# Altium schematic sheet TE0123.V2_Esquema_2022-08-20.schdoc
size 612 x 429 mm
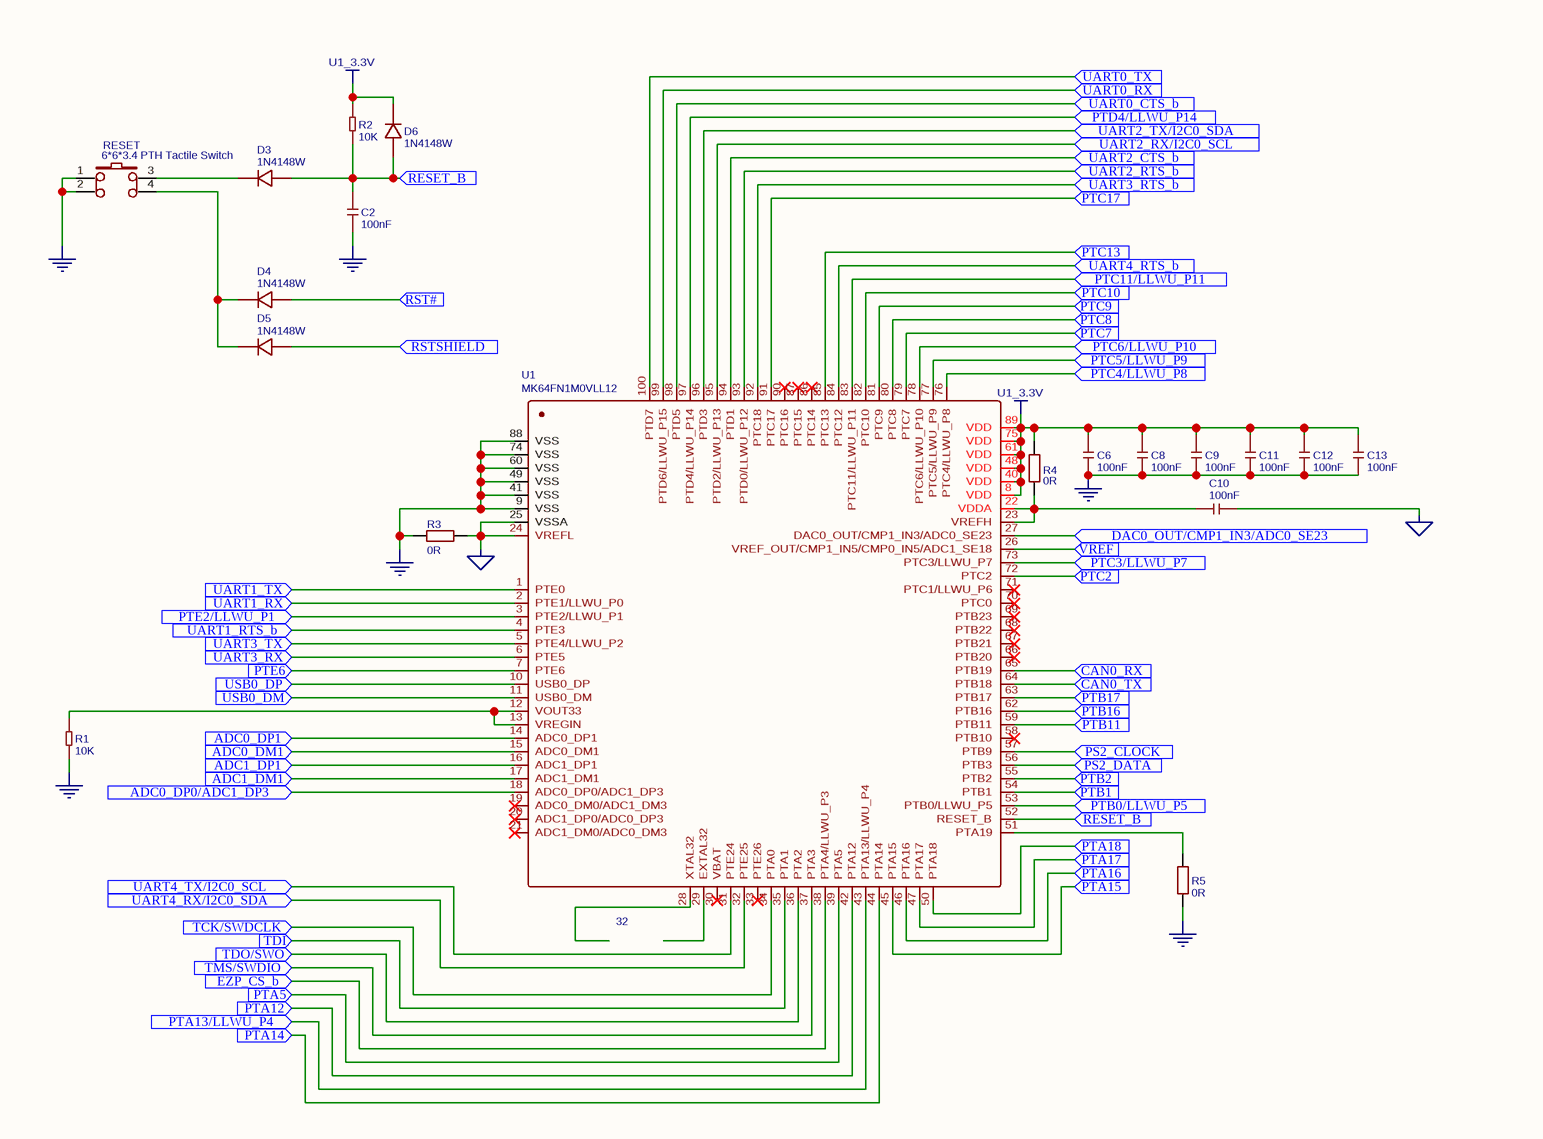
[diagram p0: TE0123.V2_Esquema_2022-08-20.schdoc, top left]
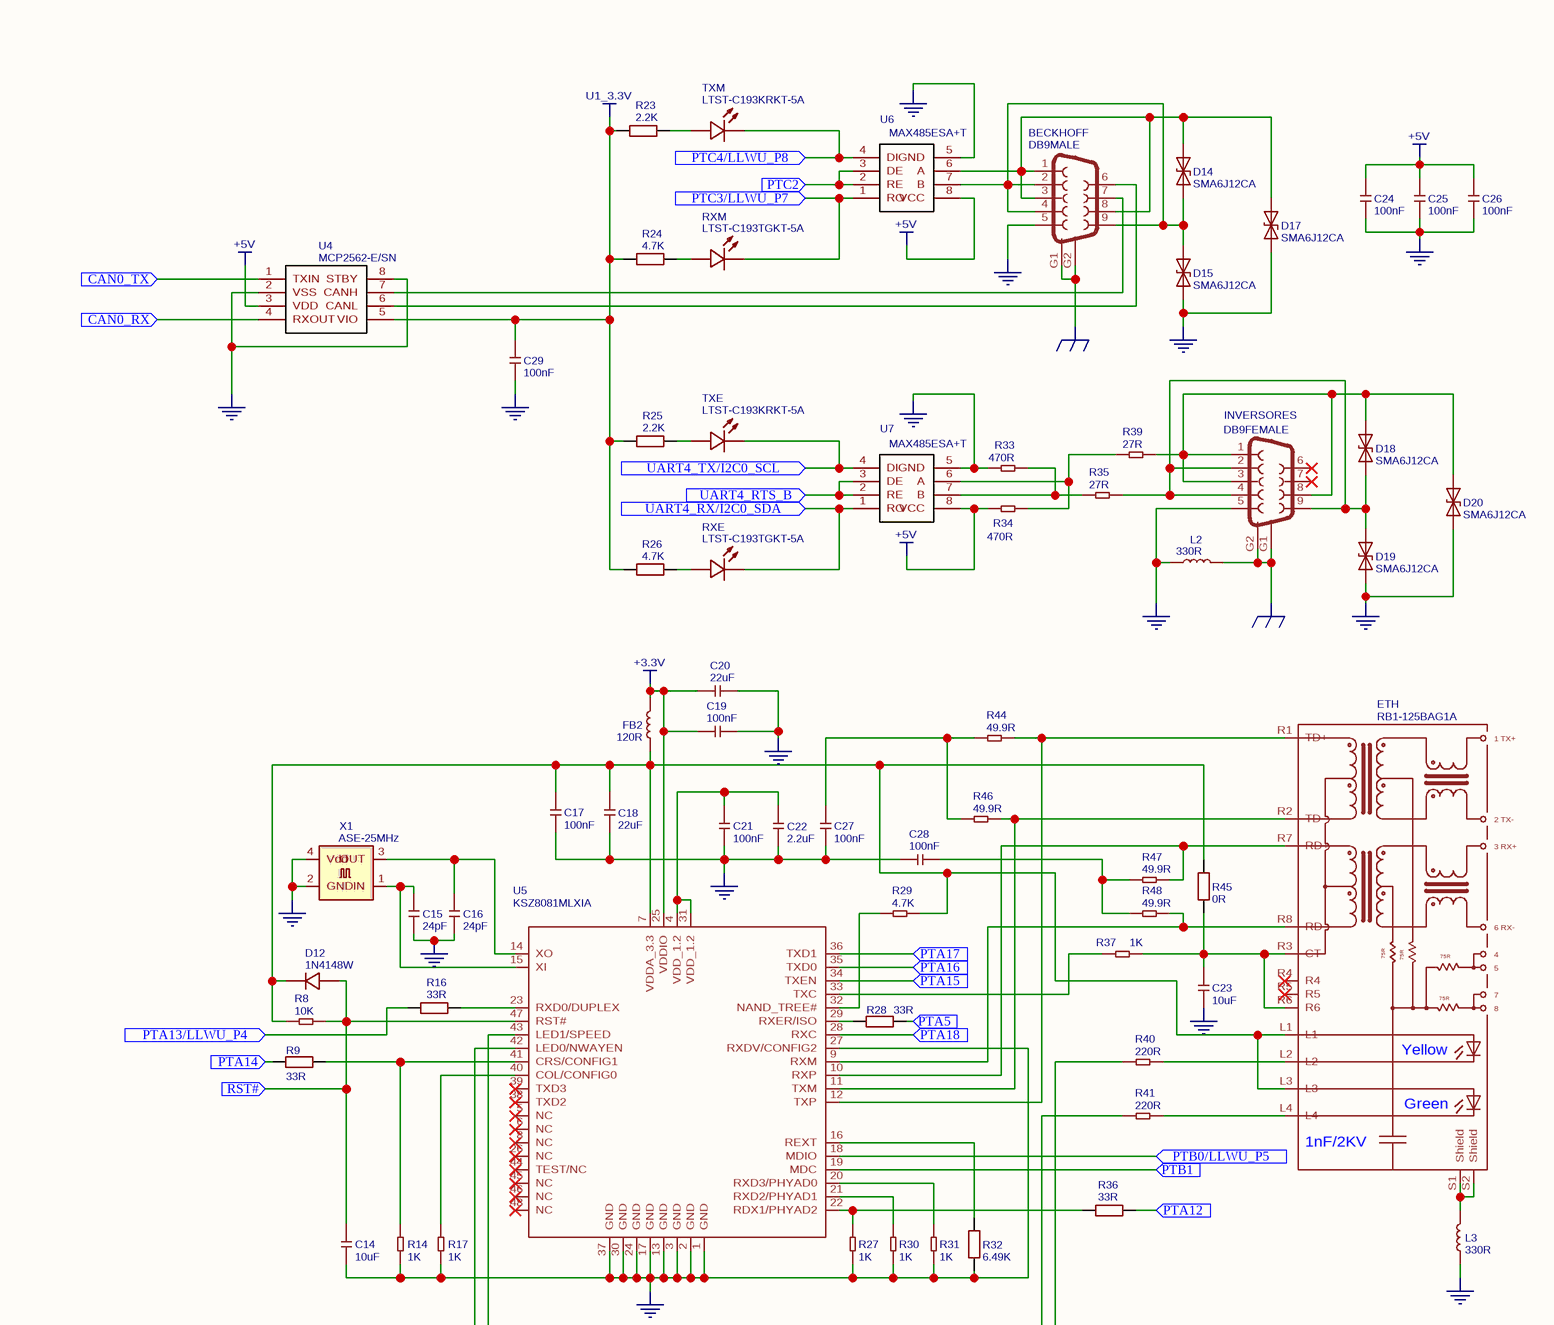
[diagram p1: TE0123.V2_Esquema_2022-08-20.schdoc, top right]
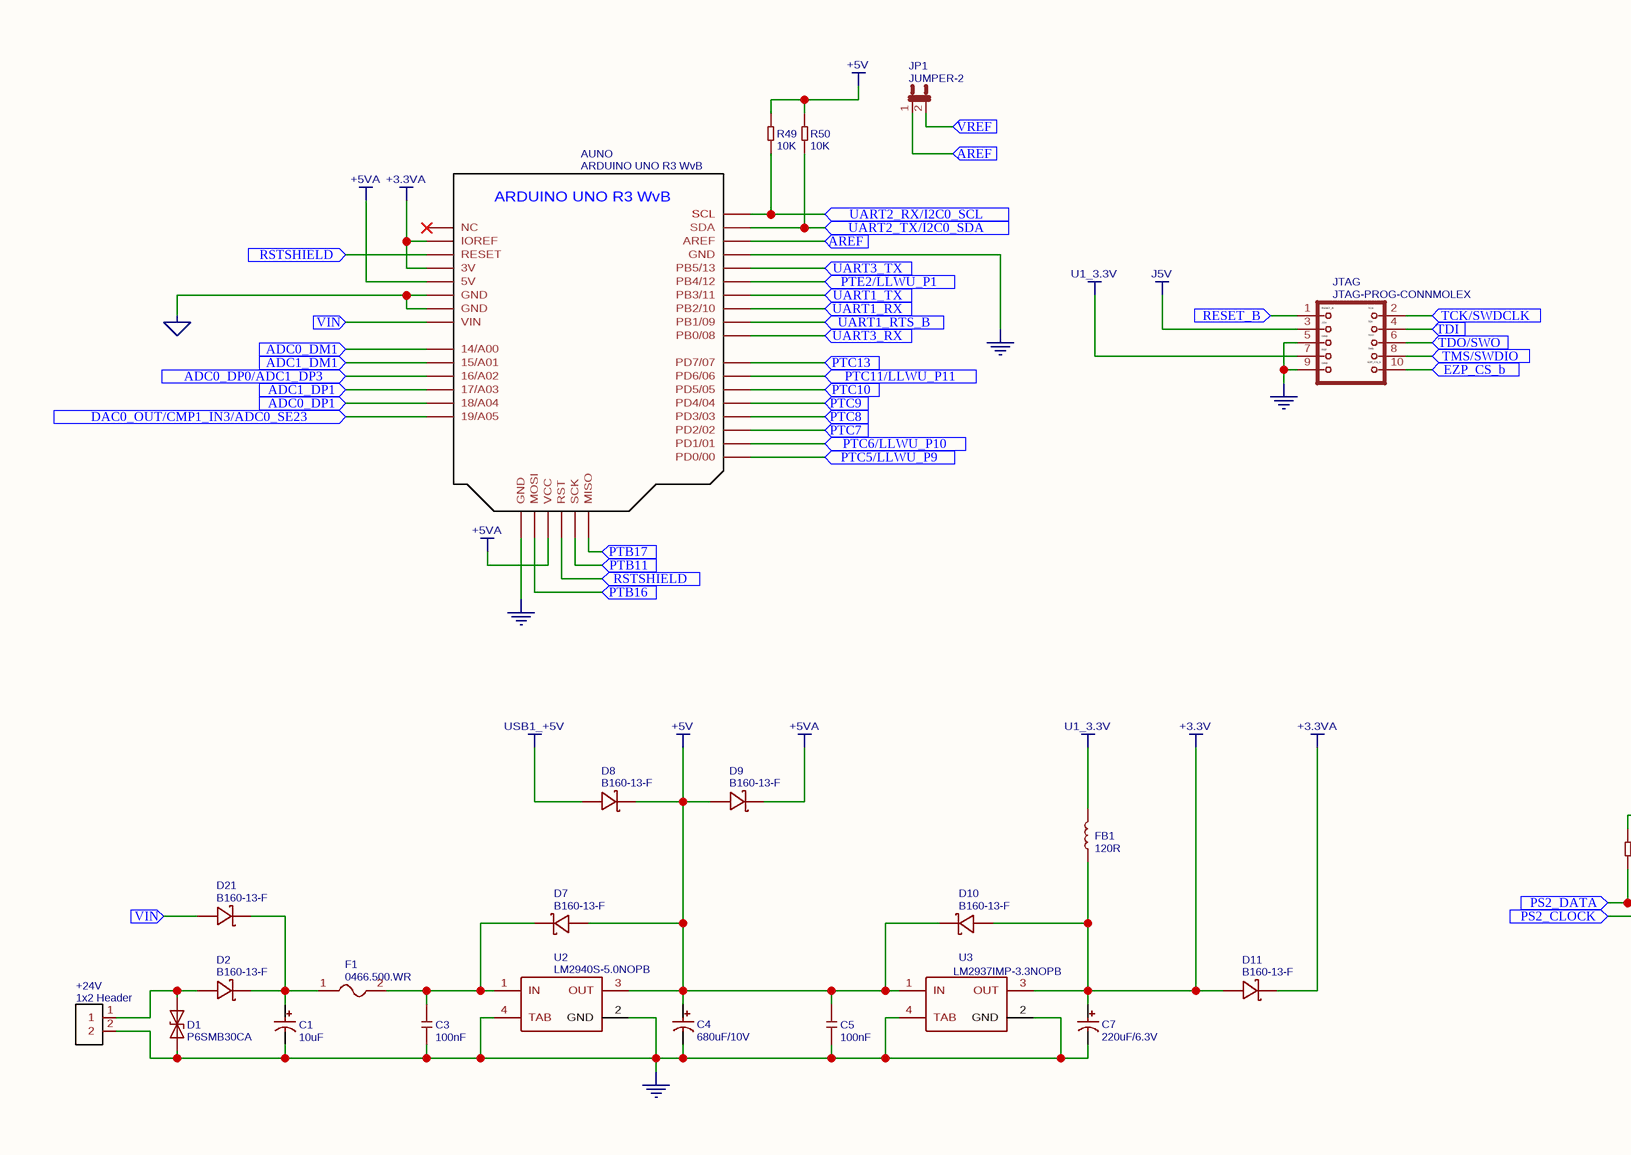
[diagram p2: TE0123.V2_Esquema_2022-08-20.schdoc, bottom left]
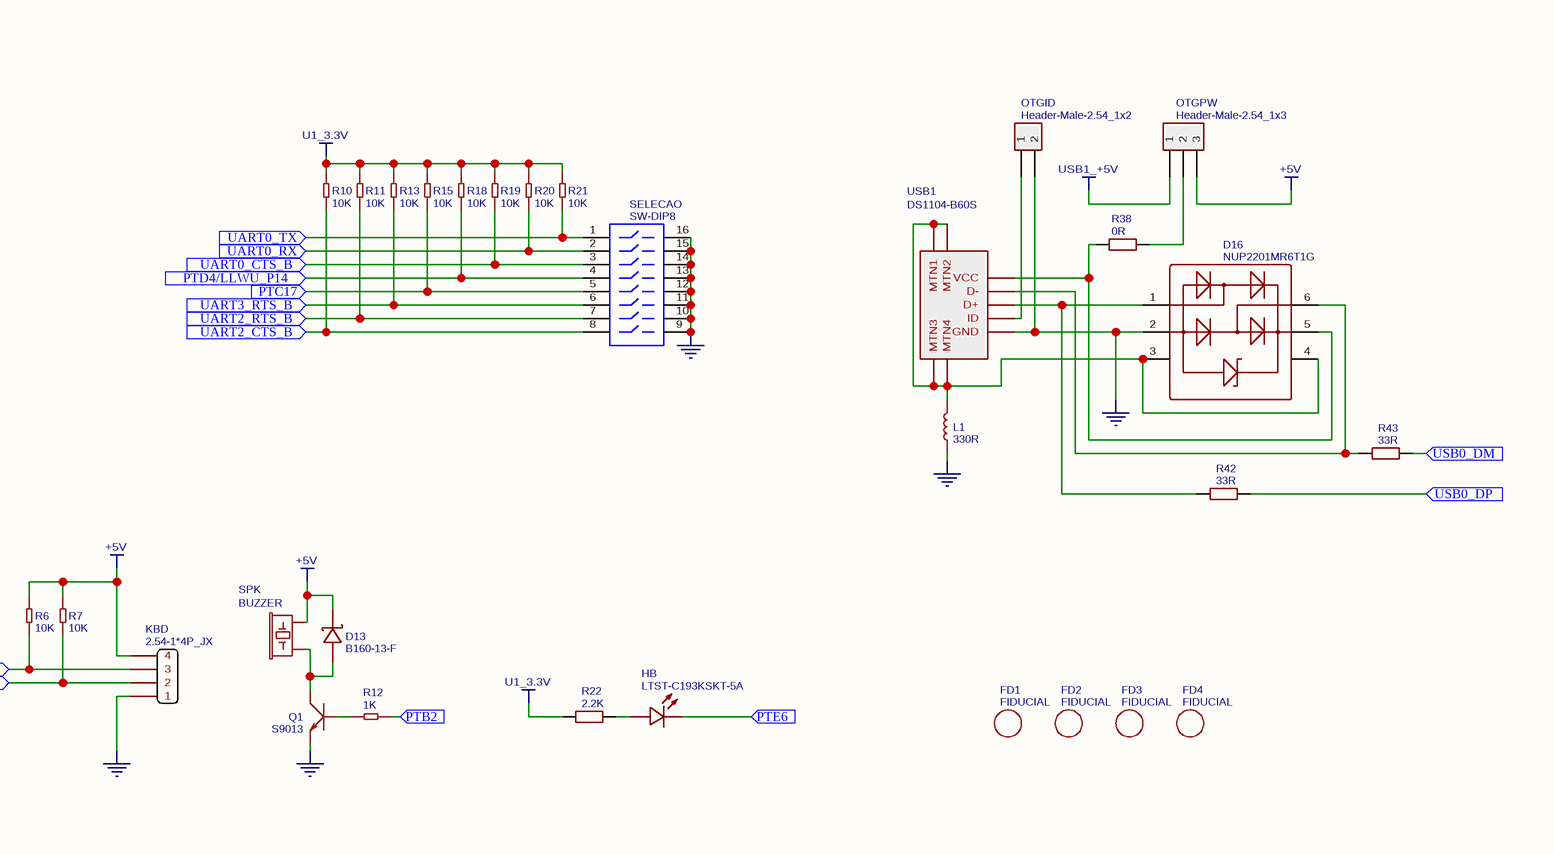
[diagram p3: TE0123.V2_Esquema_2022-08-20.schdoc, bottom right]

## Parts
32  32.768KHz  [SMD-1610_2P]  (value not drawn)
+24V  1x2 Header  [HDR1X2]
AUNO  ARDUINO UNO R3 WvB  [12ARDUINO UNO R3 NOSILK NOHOLES]
BECKHOFF  DB9MALE  [DB9_MALE]
C1  10uF  [CAP-D5.0XF2.0]
C2  100nF  [C0603]
C3  100nF  [C0603]
C4  680uF/10V  [CAP-D8.0XF3.5]
C5  100nF  [C0603]
C6  100nF  [C0603]
C7  220uF/6.3V  [CAP-D5.0XF2.0]
C8  100nF  [C0603]
C9  100nF  [C0603]
C10  100nF  [C0603]
C11  100nF  [C0603]
C12  100nF  [C0603]
C13  100nF  [C0603]
C14  10uF  [C0805]
C15  24pF  [C0603]
C16  24pF  [C0603]
C17  100nF  [C0603]
C18  22uF  [C0805]
C19  100nF  [C0603]
C20  22uF  [C0805]
C21  100nF  [C0603]
C22  2.2uF  [C0603]
C23  10uF  [C0805]
C24  100nF  [C0603]
C25  100nF  [C0603]
C26  100nF  [C0603]
C27  100nF  [C0603]
C28  100nF  [C0603]
C29  100nF  [C0603]
D1  P6SMB30CA  [SMA(DO-214ACA)]
D2  B160-13-F  [SMA(DO-214AC)]
D3  1N4148W  [SOD-123]
D4  1N4148W  [SOD-123]
D5  1N4148W  [SOD-123]
D6  1N4148W  [SOD-123]
D7  B160-13-F  [SMA(DO-214AC)]
D8  B160-13-F  [SMA(DO-214AC)]
D9  B160-13-F  [SMA(DO-214AC)]
D10  B160-13-F  [SMA(DO-214AC)]
D11  B160-13-F  [SMA(DO-214AC)]
D12  1N4148W  [SOD-123]
D13  B160-13-F  [SMA(DO-214AC)]
D14  SMA6J12CA  [SMA(DO-214ACA)]
D15  SMA6J12CA  [SMA(DO-214ACA)]
D16  NUP2201MR6T1G  [SOT-23-6]
D17  SMA6J12CA  [SMA(DO-214ACA)]
D18  SMA6J12CA  [SMA(DO-214ACA)]
D19  SMA6J12CA  [SMA(DO-214ACA)]
D20  SMA6J12CA  [SMA(DO-214ACA)]
D21  B160-13-F  [SMA(DO-214AC)]
ETH  RB1-125BAG1A  [RB1-125BAG1A]
F1  0466.500.WR  [1206]
FB1  120R  [L0603]
FB2  120R  [L0603]
FD1  FIDUCIAL  [FIDUCIAL_1MM]
FD2  FIDUCIAL  [FIDUCIAL_1MM]
FD3  FIDUCIAL  [FIDUCIAL_1MM]
FD4  FIDUCIAL  [FIDUCIAL_1MM]
HB  LTST-C193KSKT-5A  [0603]
INVERSORES  DB9FEMALE  [DB9]
JP1  JUMPER-2  [SJ_2S-NO-NS]
JTAG  JTAG-PROG-CONNMOLEX  [JTAG-10PIN-2.54MM-PTH]
KBD  2.54-1*4P_JX  [H4-2.54]
L1  330R  [L0805]
L2  330R  [L0805]
L3  330R  [L0805]
OTGID  Header-Male-2.54_1x2  [HDR-2X1/2.54]
OTGPW  Header-Male-2.54_1x3  [HDR-3X1/2.54]
Q1  S9013  [SEEED-SOT-23]
R1  10K  [R0603]
R2  10K  [R0603]
R3  0R  [0603]
R4  0R  [0603]
R5  0R  [0603]
R6  10K  [R0603]
R7  10K  [R0603]
R8  10K  [R0603]
R9  33R  [0603]
R10  10K  [R0603]
R11  10K  [R0603]
R12  1K  [R0603]
R13  10K  [R0603]
R14  1K  [R0603]
R15  10K  [R0603]
R16  33R  [0603]
R17  1K  [R0603]
R18  10K  [R0603]
R19  10K  [R0603]
R20  10K  [R0603]
R21  10K  [R0603]
R22  2.2K  [0603]
R23  2.2K  [0603]
R24  4.7K  [0603]
R25  2.2K  [0603]
R26  4.7K  [0603]
R27  1K  [R0603]
R28  33R  [0603]
R29  4.7K  [R0603]
R30  1K  [R0603]
R31  1K  [R0603]
R32  6.49K  [0603]
R33  470R  [R0805]
R34  470R  [R0805]
R35  27R  [R0805]
R36  33R  [0603]
R37  1K  [R0603]
R38  0R  [0603]
R39  27R  [R0805]
R40  220R  [R0603]
R41  220R  [R0603]
R42  33R  [0603]
R43  33R  [0603]
R44  49.9R  [R0603]
R45  0R  [0603]
R46  49.9R  [R0603]
R47  49.9R  [R0603]
R48  49.9R  [R0603]
R49  10K  [R0603]
R50  10K  [R0603]
RESET  6*6*3.4 PTH Tactile Switch  [TACTILE SWITCH]
RXE  LTST-C193TGKT-5A  [0603]
RXM  LTST-C193TGKT-5A  [0603]
SELECAO  SW-DIP8  [DIP SWITCH 16]
SPK  BUZZER  [BUZZER-12MM-KIT]
TXE  LTST-C193KRKT-5A  [0603]
TXM  LTST-C193KRKT-5A  [0603]
U1  MK64FN1M0VLL12  [LQFP-100_14X14X05P]
U2  LM2940S-5.0NOPB  [TS3B]
U3  LM2937IMP-3.3NOPB  [SOT-223]
U4  MCP2562-E/SN  [SOP-8_150MIL]
U5  KSZ8081MLXIA  [LQFP48]
U6  MAX485ESA+T  [SOIC-8_150MIL]
U7  MAX485ESA+T  [SOIC-8_150MIL]
USB1  DS1104-B60S  [MICRO-USB-13]
X1  ASE-25MHz  [OSCILLATOR_SMD_ABRACON_ASE-4PIN_3.2X2.5MM]

## Ports
ADC0_DM1 (in), ADC0_DP0/ADC1_DP3 (in), ADC0_DP1 (in), ADC1_DM1 (in), ADC1_DP1 (in), AREF (in), CAN0_RX (in), CAN0_TX (in), DAC0_OUT/CMP1_IN3/ADC0_SE23 (in), EZP_CS_b (in), PS2_CLOCK (in), PS2_DATA (in), PTA5 (in), PTA12 (in), PTA13/LLWU_P4 (in), PTA14 (in), PTA15 (in), PTA16 (in), PTA17 (in), PTA18 (in), PTB0/LLWU_P5 (in), PTB1 (in), PTB2 (in), PTB11 (in), PTB16 (in), PTB17 (in), PTC2 (in), PTC3/LLWU_P7 (in), PTC4/LLWU_P8 (in), PTC5/LLWU_P9 (in), PTC6/LLWU_P10 (in), PTC7 (in), PTC8 (in), PTC9 (in), PTC10 (in), PTC11/LLWU_P11 (in), PTC13 (in), PTC17 (in), PTD4/LLWU_P14 (in), PTE2/LLWU_P1 (in), PTE6 (in), RESET_B (in), RST# (in), RSTSHIELD (in), TCK/SWDCLK (in), TDI (in), TDO/SWO (in), TMS/SWDIO (in), UART0_CTS_b (in), UART0_CTS_B (in), UART0_RX (in), UART0_TX (in), UART1_RTS_b (in), UART1_RTS_B (in), UART1_RX (in), UART1_TX (in), UART2_CTS_b (in), UART2_CTS_B (in), UART2_RTS_b (in), UART2_RTS_B (in), UART2_RX/I2C0_SCL (in), UART2_TX/I2C0_SDA (in), UART3_RTS_b (in), UART3_RTS_B (in), UART3_RX (in), UART3_TX (in), UART4_RTS_b (in), UART4_RTS_B (in), UART4_RX/I2C0_SDA (in), UART4_TX/I2C0_SCL (in), USB0_DM (in), USB0_DP (in), VIN (in), VREF (in)

## Nets
+3.3V: C7.1 C19.2 C20.1 D10.1(A) D11.1(A) FB1.1 FB2.1 U3.3(OUT) U5.25(VDDIO)
+3.3VA: AUNO.29(3V) AUNO.31(IOREF) D11.2(K)
+5V: C4.1 C5.2 C24.2 C25.2 C26.2 D7.1(A) D8.2(K) D9.1(A) D10.2(K) D13.2(K) KBD.4 OTGPW.3 R6.2 R7.2 R34.2 R49.2 R50.2 SPK.+ U2.3(OUT) U3.1(IN) U4.3(VDD) U6.8(VCC) U7.8(VCC)
+5VA: AUNO.28(5V) AUNO.37(VCC) D9.2(K)
AGND: AUNO.26(GND) AUNO.27(GND) C10.1 R3.2 U1.24(VREFL) U1.25(VSSA)
CHASSI_RS485: BECKHOFF.G1 BECKHOFF.G2 INVERSORES.G1 INVERSORES.G2 L2.1
GND: +24V.2 AUNO.15(GND) AUNO.38(GND) BECKHOFF.5 C1.2 C2.1 C3.1 C4.2 C5.1 C6.1 C7.2 C8.1 C9.1 C11.1 C12.1 C13.2 C14.1 C15.1 C16.1 C17.1 C18.1 C19.1 C20.2 C21.1 C22.1 C23.1 C24.1 C25.1 C26.1 C27.1 C28.2 C29.1 D1.2(A) D15.2(A) D16.2 D17.2(A) D19.2(A) D20.2(A) INVERSORES.5 JTAG.5 JTAG.9 KBD.1 L1.1 L2.2 L3.1 OTGID.2 Q1.2(E) R1.1 R3.1 R5.1 R14.2 R17.2 R27.1 R30.1 R31.1 R32.1 R33.2 RESET.1 RESET.2 SELECAO.9 SELECAO.10 SELECAO.11 SELECAO.12 SELECAO.13 SELECAO.14 SELECAO.15 SELECAO.16 U1.9(VSS) U1.41(VSS) U1.49(VSS) U1.60(VSS) U1.74(VSS) U1.88(VSS) U2.2(GND) U2.4(TAB) U3.2(GND) U3.4(TAB) U4.2(VSS) U4.8(STBY) U5.1(GND) U5.2(GND) U5.3(GND) U5.13(GND) U5.17(GND) U5.24(GND) U5.27(RXDV/CONFIG2) U5.30(GND) U5.37(GND) U6.5(GND) U7.5(GND) USB1.5(GND) X1.2(GND) X1.4(Vdd)
J5V: JTAG.3
U1_3.3V: C6.2 C8.2 C9.2 C11.2 C12.2 C13.1 C29.2 D6.1(K) FB1.2 JTAG.7 R2.2 R4.2 R10.2 R11.2 R13.2 R15.2 R18.2 R19.2 R20.2 R21.2 R22.1 R23.1 R24.1 R25.1 R26.1 U1.8(VDD) U1.40(VDD) U1.48(VDD) U1.61(VDD) U1.75(VDD) U1.89(VDD) U4.5(VIO)
USB1_+5V: D8.1(A) OTGPW.1
ADC0_DM1: AUNO.24(14/A00) U1.15(ADC0_DM1) ; port ADC0_DM1
ADC0_DP0/ADC1_DP3: AUNO.22(16/A02) U1.18(ADC0_DP0/ADC1_DP3) ; port ADC0_DP0/ADC1_DP3
ADC0_DP1: AUNO.20(18/A04) U1.14(ADC0_DP1) ; port ADC0_DP1
ADC1_DM1: AUNO.23(15/A01) U1.17(ADC1_DM1) ; port ADC1_DM1
ADC1_DP1: AUNO.21(17/A03) U1.16(ADC1_DP1) ; port ADC1_DP1
AREF: AUNO.16(AREF) JP1.1 ; port AREF
CAN0_RX: U1.65(PTB19) U4.4(RXOUT) ; port CAN0_RX
CAN0_TX: U1.64(PTB18) U4.1(TXIN) ; port CAN0_TX
DAC0_OUT/CMP1_IN3/ADC0_SE23: AUNO.19(19/A05) U1.27(DAC0_OUT/CMP1_IN3/ADC0_SE23) ; port DAC0_OUT/CMP1_IN3/ADC0_SE23
EZP_CS_b: JTAG.10 U1.38(PTA4/LLWU_P3) ; port EZP_CS_b
PS2_CLOCK: KBD.2 R7.1 U1.57(PTB9) ; port PS2_CLOCK
PS2_DATA: KBD.3 R6.1 U1.56(PTB3) ; port PS2_DATA
PTA5: R28.2 U1.39(PTA5) ; port PTA5
PTA12: R36.1 U1.42(PTA12) ; port PTA12
PTA13/LLWU_P4: R16.1 U1.43(PTA13/LLWU_P4) ; port PTA13/LLWU_P4
PTA14: R9.2 U1.44(PTA14) ; port PTA14
PTA15: U1.45(PTA15) U5.34(TXEN) ; port PTA15
PTA16: U1.46(PTA16) U5.35(TXD0) ; port PTA16
PTA17: U1.47(PTA17) U5.36(TXD1) ; port PTA17
PTA18: U1.50(PTA18) U5.28(RXC) ; port PTA18
PTB0/LLWU_P5: U1.53(PTB0/LLWU_P5) U5.18(MDIO) ; port PTB0/LLWU_P5
PTB1: U1.54(PTB1) U5.19(MDC) ; port PTB1
PTB2: R12.2 U1.55(PTB2) ; port PTB2
PTB11: AUNO.34(SCK) U1.59(PTB11) ; port PTB11
PTB16: AUNO.36(MOSI) U1.62(PTB16) ; port PTB16
PTB17: AUNO.33(MISO) U1.63(PTB17) ; port PTB17
PTC2: U1.72(PTC2) U6.2(RE) U6.3(DE) ; port PTC2
PTC3/LLWU_P7: RXM.1(K) U1.73(PTC3/LLWU_P7) U6.1(RO) ; port PTC3/LLWU_P7
PTC4/LLWU_P8: TXM.1(K) U1.76(PTC4/LLWU_P8) U6.4(DI) ; port PTC4/LLWU_P8
PTC5/LLWU_P9: AUNO.1(PD0/00) U1.77(PTC5/LLWU_P9) ; port PTC5/LLWU_P9
PTC6/LLWU_P10: AUNO.2(PD1/01) U1.78(PTC6/LLWU_P10) ; port PTC6/LLWU_P10
PTC7: AUNO.3(PD2/02) U1.79(PTC7) ; port PTC7
PTC8: AUNO.4(PD3/03) U1.80(PTC8) ; port PTC8
PTC9: AUNO.5(PD4/04) U1.81(PTC9) ; port PTC9
PTC10: AUNO.6(PD5/05) U1.82(PTC10) ; port PTC10
PTC11/LLWU_P11: AUNO.7(PD6/06) U1.83(PTC11/LLWU_P11) ; port PTC11/LLWU_P11
PTC13: AUNO.8(PD7/07) U1.85(PTC13) ; port PTC13
PTC17: R15.1 SELECAO.5 U1.91(PTC17) ; port PTC17
PTD4/LLWU_P14: R18.1 SELECAO.4 U1.97(PTD4/LLWU_P14) ; port PTD4/LLWU_P14
PTE2/LLWU_P1: AUNO.13(PB4/12) U1.3(PTE2/LLWU_P1) ; port PTE2/LLWU_P1
PTE6: HB.1(K) U1.7(PTE6) ; port PTE6
RESET_B: C2.2 D3.2(A) D6.2(A) JTAG.1 R2.1 U1.52(RESET_B) ; port RESET_B
RST#: C14.2 D4.2(A) D12.2(A) R8.1 U5.47(RST#) ; port RST#
RSTSHIELD: AUNO.30(RESET) AUNO.35(RST) D5.2(A) ; port RSTSHIELD
TCK/SWDCLK: JTAG.2 U1.34(PTA0) ; port TCK/SWDCLK
TDI: JTAG.4 U1.35(PTA1) ; port TDI
TDO/SWO: JTAG.6 U1.36(PTA2) ; port TDO/SWO
TMS/SWDIO: JTAG.8 U1.37(PTA3) ; port TMS/SWDIO
UART0_CTS_b: R19.1 SELECAO.3 U1.98(PTD5) ; port UART0_CTS_b, port UART0_CTS_B
UART0_RX: R20.1 SELECAO.2 U1.99(PTD6/LLWU_P15) ; port UART0_RX
UART0_TX: R21.1 SELECAO.1 U1.100(PTD7) ; port UART0_TX
UART1_RTS_b: AUNO.10(PB1/09) U1.4(PTE3) ; port UART1_RTS_b, port UART1_RTS_B
UART1_RX: AUNO.11(PB2/10) U1.2(PTE1/LLWU_P0) ; port UART1_RX
UART1_TX: AUNO.12(PB3/11) U1.1(PTE0) ; port UART1_TX
UART2_CTS_b: R10.1 SELECAO.8 U1.94(PTD1) ; port UART2_CTS_b, port UART2_CTS_B
UART2_RTS_b: R11.1 SELECAO.7 U1.93(PTD0/LLWU_P12) ; port UART2_RTS_b, port UART2_RTS_B
UART2_RX/I2C0_SCL: AUNO.18(SCL) R49.1 U1.95(PTD2/LLWU_P13) ; port UART2_RX/I2C0_SCL
UART2_TX/I2C0_SDA: AUNO.17(SDA) R50.1 U1.96(PTD3) ; port UART2_TX/I2C0_SDA
UART3_RTS_b: R13.1 SELECAO.6 U1.92(PTC18) ; port UART3_RTS_b, port UART3_RTS_B
UART3_RX: AUNO.9(PB0/08) U1.6(PTE5) ; port UART3_RX
UART3_TX: AUNO.14(PB5/13) U1.5(PTE4/LLWU_P2) ; port UART3_TX
UART4_RTS_b: U1.84(PTC12) U7.2(RE) U7.3(DE) ; port UART4_RTS_b, port UART4_RTS_B
UART4_RX/I2C0_SDA: RXE.1(K) U1.32(PTE25) U7.1(RO) ; port UART4_RX/I2C0_SDA
UART4_TX/I2C0_SCL: TXE.1(K) U1.31(PTE24) U7.4(DI) ; port UART4_TX/I2C0_SCL
USB0_DM: R43.2 U1.11(USB0_DM) ; port USB0_DM
USB0_DP: R42.2 U1.10(USB0_DP) ; port USB0_DP
VIN: AUNO.25(VIN) D21.1(A) ; port VIN
VREF: JP1.2 U1.26(VREF_OUT/CMP1_IN5/CMP0_IN5/ADC1_SE18) ; port VREF
Net+24V_1: +24V.1 D1.1(K) D2.1(A)
NetBECKHOFF_1: BECKHOFF.1 BECKHOFF.3 BECKHOFF.8 D14.1(K) D17.1(K) U6.6(A)
NetBECKHOFF_2: BECKHOFF.2 BECKHOFF.4 BECKHOFF.9 D14.2(A) D15.1(K) U6.7(B)
NetBECKHOFF_6: BECKHOFF.6 U4.6(CANL)
NetBECKHOFF_7: BECKHOFF.7 U4.7(CANH)
NetC1_1: C1.1 D2.2(K) D21.2(K) F1.1
NetC3_2: C3.2 D7.2(K) F1.2 U2.1(IN)
NetC10_2: C10.2 R4.1 U1.22(VDDA) U1.23(VREFH)
NetC15_2: C15.2 U5.15(XI) X1.1(IN)
NetC16_2: C16.2 U5.14(XO) X1.3(OUT)
NetC17_2: C17.2 C18.2 D12.1(K) ETH.L1 ETH.L3 FB2.2 R8.2 R29.1 R45.2 U5.7(VDDA_3.3)
NetC21_2: C21.2 C22.2 U5.4(VDD_1.2) U5.31(VDD_1.2)
NetC23_2: C23.2 ETH.R3(CT) ETH.R6 R37.1 R45.1
NetC27_2: C27.2 R44.1 R46.1
NetC28_1: C28.1 R47.1 R48.1
NetD3_1: D3.1(K) RESET.3
NetD4_1: D4.1(K) D5.1(K) RESET.4
NetD13_1: D13.1(A) Q1.3(C) SPK.-
NetD16_1: D16.1 R42.1 USB1.3(D+)
NetD16_3: D16.3 D16.4 L1.2 USB1.0(MTN4)
NetD16_5: D16.5 R38.2 USB1.1(VCC)
NetD16_6: D16.6 R43.1 USB1.2(D-)
NetD18_1: D18.1(K) D20.1(K) INVERSORES.1 INVERSORES.3 INVERSORES.8 R39.1
NetD18_2: D18.2(A) D19.1(K) INVERSORES.2 INVERSORES.4 INVERSORES.9 R35.1
NetETH_L2: ETH.L2 R40.2
NetETH_L4: ETH.L4 R41.2
NetETH_R1: ETH.R1(TD+) R44.2 U5.12(TXP)
NetETH_R2: ETH.R2(TD-) R46.2 U5.11(TXM)
NetETH_R7: ETH.R7(RD+) R47.2 U5.10(RXP)
NetETH_R8: ETH.R8(RD-) R48.2 U5.9(RXM)
NetETH_S1: ETH.S1(Shield) ETH.S2(Shield) L3.2
NetHB_2: HB.2(A) R22.2
NetOTGID_1: OTGID.1 USB1.4(ID)
NetOTGPW_2: OTGPW.2 R38.1
NetQ1_1: Q1.1(B) R12.1
NetR1_2: R1.2 U1.12(VOUT33) U1.13(VREGIN)
NetR5_2: R5.2 U1.51(PTA19)
NetR9_1: R9.1 R14.1 U5.41(CRS/CONFIG1)
NetR16_2: R16.2 U5.23(RXD0/DUPLEX)
NetR17_1: R17.1 U5.40(COL/CONFIG0)
NetR23_2: R23.2 TXM.2(A)
NetR24_2: R24.2 RXM.2(A)
NetR25_2: R25.2 TXE.2(A)
NetR26_2: R26.2 RXE.2(A)
NetR27_2: R27.2 R36.2 U5.22(RDX1/PHYAD2)
NetR28_1: R28.1 U5.29(RXER/ISO)
NetR29_2: R29.2 U5.32(NAND_TREE#)
NetR30_2: R30.2 U5.21(RXD2/PHYAD1)
NetR31_2: R31.2 U5.20(RXD3/PHYAD0)
NetR32_2: R32.2 U5.16(REXT)
NetR33_1: R33.1 R35.2 U7.7(B)
NetR34_1: R34.1 R39.2 U7.6(A)
NetR37_2: R37.2 U5.33(TXC)
NetR40_1: R40.1 U5.42(LED0/NWAYEN)
NetR41_1: R41.1 U5.43(LED1/SPEED)

Not connected (* = marked no-connect by the designer): AUNO 32(NC)*; ETH R4* R5*; INVERSORES 6* 7*; U1 19(ADC0_DM0/ADC1_DM3)* 20(ADC1_DP0/ADC0_DP3)* 21(ADC1_DM0/ADC0_DM3)* 28(XTAL32) 29(EXTAL32) 30(VBAT)* 33(PTE26)* 58(PTB10)* 66(PTB20)* 67(PTB21)* 68(PTB22)* 69(PTB23)* 70(PTC0)* 71(PTC1/LLWU_P6)* 86(PTC14)* 87(PTC15)* 90(PTC16)*; U5 5(NC)* 6(NC)* 8(NC)* 26(NC)* 38(TXD2)* 39(TXD3)* 44(TEST/NC)* 45(NC)* 46(NC)* 48(NC)*

## Notes on the sheet
- (in symbol JTAG-PROG-CONNMOLEX) RESET_B; TCK; J5V; TDI; GND; TDO; REF; TMS; EZP_CS_b
- (in symbol RB1-125BAG1A) 1 TX+; 2 TX-; 3 RX+; 6 RX-; 75R; 4; 5; 7; 8; Yellow; Green; 1nF/2KV

## Library data of the parts
32 = 32.768KHz: BOM_Manufacturer: KDS; BOM_Manufacturer Part: DST1610A 32.768KHz; nameAlias: Frequency; BOM_Supplier: LCSC; spicePre: X; spiceSymbolName: DST1610A 32.768KHz; BOM_Supplier Part: C93230
+24V = 1x2 Header: sourceId: 5aKIigQpn; timeStamp: 1467472897; spicePre: J
AUNO = ARDUINO UNO R3 WvB: catid: 20; sourceId: 6DP1Zb9IG; timeStamp: 1465236374; spicePre: U
BECKHOFF = DB9MALE: catid: 20; description: DB9 Connector; spicePre: J
C1 = 10uF: BOM_Manufacturer Part: URS1J100MDD; BOM_Manufacturer: NICHICON; Voltage: 63V; Value: 10uF; spicePre: C
C2 C3 C5 C6 C8-C13 C17 C19 C21 C24-C29 = 100nF: BOM_Manufacturer Part: CC0603KRX7R9BB104; BOM_Manufacturer: YAGEO; catid: 20; description: SMD CAP Ceramic 100nF-50V-10%-X7R; spicePre: C
C4 = 680uF/10V: BOM_Manufacturer: NICHICON; BOM_Manufacturer Part: UHD1A681MPD; Value: 680uF; Voltage: 10V; spicePre: C
C7 = 220uF/6.3V: BOM_Manufacturer: NICHICON; BOM_Manufacturer Part: UVZ0J221MDD; Value: 220uF; Voltage: 6.3V; spicePre: C
C14 C23 = 10uF: BOM_Manufacturer Part: CC0805KKX5R8BB106; BOM_Manufacturer: YAGEO; catid: 20; description: SMD CAP Ceramic 10uF-25V-10%-X5R; spicePre: C
C15 C16 = 24pF: BOM_Manufacturer Part: CC0603JRNPO9BN240; catid: 20; description: SMD CAP Ceramic;24pF-50V-NPO-5%; spicePre: C
C18 C20 = 22uF: BOM_Manufacturer Part: CC0805MKX5R5BB226; BOM_Manufacturer: YAGEO; catid: 20; description: SMD CAP Ceramic 22uF-6.3V-20%-X5R;; spicePre: C
C22 = 2.2uF: BOM_Manufacturer Part: CC0603KRX7R6BB225; BOM_Manufacturer: YAGEO; catid: 20; description: SMD CAP Ceramic 2.2uF-10V-10%-X7R;; spicePre: C
D1 = P6SMB30CA: BOM_Manufacturer: LITTLEFUSE; BOM_Manufacturer Part: P6SMB30CA; spicePre: D
D2 D7-D11 D13 D21 = B160-13-F: BOM_Manufacturer: DIODES; BOM_Manufacturer Part: B160-13-F; spicePre: D
D3-D6 D12 = 1N4148W: BOM_Manufacturer: ON; BOM_Manufacturer Part: L1N4148WT1G; spicePre: D
D14 D15 D17-D20 = SMA6J12CA: BOM_Manufacturer Part: P6SMB30CA; BOM_Manufacturer: LITTLEFUSE; spicePre: D
D16 = NUP2201MR6T1G: BOM_Manufacturer: ON; BOM_Manufacturer Part: NUP2201MR6T1G; spicePre: D
ETH = RB1-125BAG1A: BOM_Manufacturer: WIZNET; catid: 20; description: Accessory RJ-45 With Transformer Connector - UDE; BOM_Manufacturer Part: RB1-125BAG1A; spicePre: P
F1 = 0466.500.WR: BOM_Manufacturer: LITTLEFUSE; BOM_Manufacturer Part: 576-0437001.WR; spicePre: U
FB1 FB2 = 120R: BOM_Manufacturer Part: BLM18PG121SN1D; BOM_Manufacturer: MURATA; catid: 20; description: SMD Ferrite Bead- 120R-2A; spicePre: F
FD1-FD4 = FIDUCIAL: catid: 20; BOM_Mounted: No; spicePre: U
HB = LTST-C193KSKT-5A: BOM_Manufacturer: LITEON; BOM_Manufacturer Part: LTST-C193TGKT-5A; spicePre: L
INVERSORES = DB9FEMALE: catid: 20; description: DB9 Connector; spicePre: J
JP1 = JUMPER-2: Contributor: SparkFun; BOM_Manufacturer Part: ?; spicePre: J
JTAG = JTAG-PROG-CONNMOLEX: description: JTAG Program Connector; Contributor: PatternAgents; BOM_Manufacturer Part: ?; spicePre: J
L1-L3 = 330R: BOM_Manufacturer Part: BLM21PG331SN1D; BOM_Manufacturer: MURATA; catid: 20; description: SMD Ferrite Bead 330R-1500mA; spicePre: L
OTGID = Header-Male-2.54_1x2: BOM_Manufacturer Part: 2.54mm 1*2P; spicePre: P
OTGPW = Header-Male-2.54_1x3: BOM_Manufacturer Part: Header2.54mm 1*3P; spicePre: P
Q1 = S9013: BOM_Manufacturer Part: BC818-40LT1G; BOM_Manufacturer: ON; catid: 20; description: SMD Transistors NPN 25V-500mA; spicePre: Q
R1 R2 R6-R8 R10 R11 R13 R15 R18-R21 R49 R50 = 10K: BOM_Manufacturer Part: RC0603FR-0710KL; BOM_Manufacturer: YAGEO; catid: 20; description: SMD RES 10K-1%-1/10W; spicePre: R
R3-R5 R38 R45 = 0R: BOM_Manufacturer: UNIOHM; BOM_Manufacturer Part: 0603WAF0000T5E; Power: 1/10W; Value: 0Ω; Tolerance: ±1%; spicePre: R
  R38: BOM_LCSC Assembly: Yes
R9 R16 R28 R36 R42 R43 = 33R: BOM_Manufacturer: YAGEO; BOM_Manufacturer Part: RC0603FR-0733RL; Power: 1W; Value: 33Ω(33R); Tolerance: ±1%; spicePre: R
R12 R14 R17 R27 R30 R31 R37 = 1K: BOM_Manufacturer Part: RC0603FR-071KL; BOM_Manufacturer: YAGEO; catid: 20; description: SMD RES 1K-1%-1/10W; spicePre: R
R22 R23 R25 = 2.2K: BOM_Manufacturer: YAGEO; BOM_Manufacturer Part: RC0603JR-072K2L; Power: 1W; Value: 2.2KΩ(222); Tolerance: ±1%; spicePre: R
R24 R26 = 4.7K: BOM_Manufacturer: YAGEO; BOM_Manufacturer Part: RC0603FR-074K7L; Power: 1W; Value: 4.7KΩ(472); Tolerance: ±1%; spicePre: R
R29 = 4.7K: BOM_Manufacturer Part: RC0603JR-074K7L; BOM_Manufacturer: YAGEO; catid: 20; description: SMD RES 4.7K-5%-1/10W; spicePre: R
R32 = 6.49K: BOM_Manufacturer: UNIOHM; BOM_Manufacturer Part: 0603WAF6491T5E; Power: 1/10W; Value: 6.49KΩ; Tolerance: ±1%; spicePre: R
R33 R34 = 470R: BOM_Manufacturer Part: RC0805FR-07470RL; BOM_Manufacturer: YAGEO; catid: 20; description: SMD RES 470R-1%-1/8W; spicePre: R
R35 R39 = 27R: BOM_Manufacturer Part: RC0805FR-07470RL; BOM_Manufacturer: YAGEO; catid: 20; description: SMD RES 470R-1%-1/8W; spicePre: R
R40 R41 = 220R: BOM_Manufacturer Part: RC0603JR-07220RL; BOM_Manufacturer: YAGEO; catid: 20; description: SMD RES 220R-5%-1/10W; spicePre: R
R44 R46-R48 = 49.9R: BOM_Manufacturer Part: RC0603FR-0749R9L; BOM_Manufacturer: YAGEO; catid: 20; description: SMD RES 49.9R-1%-1/10W; spicePre: R
RESET = 6*6*3.4 PTH Tactile Switch: BOM_Manufacturer: OMRON; BOM_Manufacturer Part: 6*6*3.4 PTH Tactile Switch; spicePre: S
RXE RXM = LTST-C193TGKT-5A: BOM_Manufacturer: LITEON; BOM_Manufacturer Part: LTST-C193TGKT-5A; spicePre: L
SELECAO = SW-DIP8: BOM_Manufacturer Part: DIP SWITCH 8 VIAS; BOM_Manufacturer: CONNFLY; catid: 20; description: 4009 Series DIP Switch, Raised actuator; timeStamp: 1449457551; spicePre: S
SPK = BUZZER: catid: 20; spicePre: S
TXE TXM = LTST-C193KRKT-5A: BOM_Manufacturer: LITEON; BOM_Manufacturer Part: LTST-C193TGKT-5A; spicePre: L
U1 = MK64FN1M0VLL12: BOM_Manufacturer: NXP/FREESCALE; BOM_Manufacturer Part: MK64FN1M0VLL12; spicePre: U
U2 = LM2940S-5.0NOPB: BOM_Manufacturer Part: LM2940S-5.0/NOPB; BOM_Manufacturer: TEXAS; catid: 20; description: 1A Low Dropout Regulator, 3-pin TO-263, Pb-Free; spicePre: U
U3 = LM2937IMP-3.3NOPB: BOM_Manufacturer Part: LM2937IMP-3.3/NOPB; BOM_Manufacturer: TEXAS; catid: 20; description: 400mA and 500mA Voltage Regulator, 4-pin SOT-223, Pb-Free; spicePre: U
U4 = MCP2562-E/SN: BOM_Manufacturer: MICROCHIP; Contributor: MARCODEOLI; BOM_Supplier: LCSC; BOM_Manufacturer Part: MCP2562-E/SN; image: //image.lceda.cn/szlcsc/C53609.jpg; spicePre: U; BOM_Supplier Part: C53609
U5 = KSZ8081MLXIA: BOM_Manufacturer: MICROCHIP/MICREL; catid: 20; BOM_Manufacturer Part: KSZ8081MLXIA; spicePre: U
U6 U7 = MAX485ESA+T: BOM_Manufacturer: MAXIM; BOM_Manufacturer Part: MAX485ESA+T; spicePre: U
USB1 = DS1104-B60S: BOM_Manufacturer: CONNFLY; BOM_Manufacturer Part: DS1104-B60S; spicePre: U
X1 = ASE-25MHz: BOM_Manufacturer: ABRACON; spicePre: X
KBD = 2.54-1*4P_JX: spicePre: P